# Altium schematic sheet [08] -LoRa_RAK3172.SchDoc
size A4
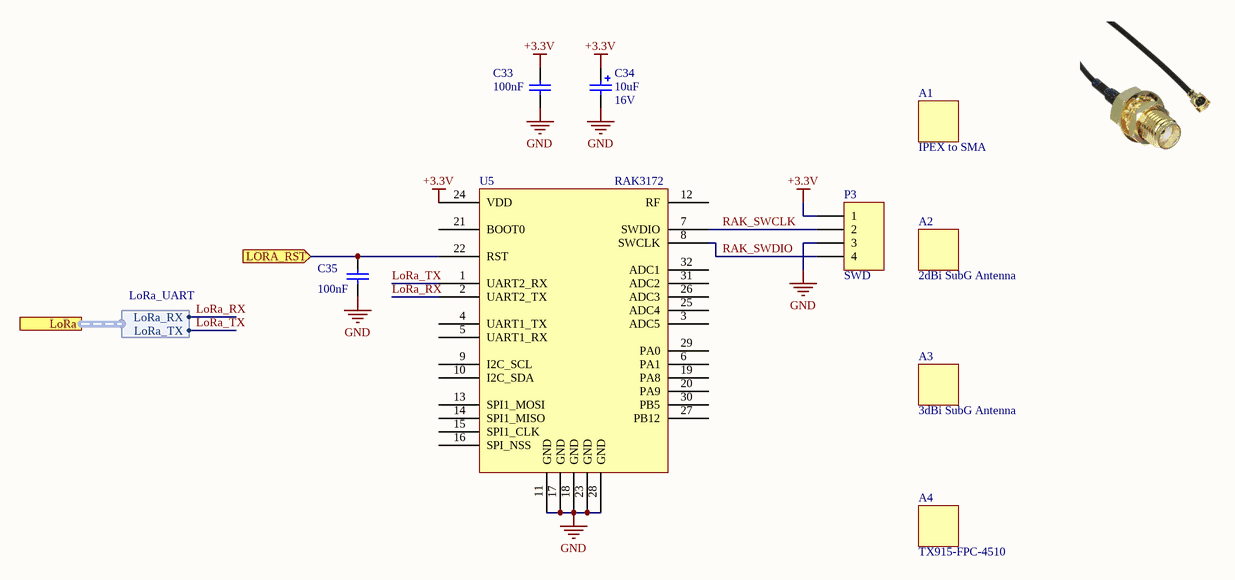
[diagram p0: [08] -LoRa_RAK3172.SchDoc]

## Parts
A1  IPEX to SMA  (mechanical)
A2  2dBi SubG Antenna  (mechanical)
A3  3dBi SubG Antenna  (mechanical)
A4  TX915-FPC-4510  (mechanical)
C33  Capacitance: 100nF  [Cap 0603]  (hidden comment: Capacitor)
C34  Capacitance: 10uF  Voltage Rating: 16V  [Tantalum 3216 A]  (hidden comment: Capacitor Polarized)
C35  Capacitance: 100nF  [Cap 0603]  (hidden comment: Capacitor)
P3  SWD  [HEADER SMD]
U5  RAK3172  [RAK3172]

## Ports
LoRa (harness LoRa_UART), LORA_RST (in)

## Harnesses
LoRa_UART: LoRa_RX, LoRa_TX

## Nets
+3.3V: C33.2 C34.1 P3.1 U5.24(VDD)
GND: C33.1 C34.2 C35.1 P3.3 U5.11(GND) U5.17(GND) U5.18(GND) U5.23(GND) U5.28(GND)
LORA_RST: C35.2 U5.22(RST) ; port LORA_RST
LoRa_RX: U5.2(UART2_TX) ; port LoRa.LoRa_RX
LoRa_TX: U5.1(UART2_RX) ; port LoRa.LoRa_TX
RAK_SWCLK: P3.2 U5.7(SWDIO)
RAK_SWDIO: P3.4 U5.8(SWCLK)

Not connected (* = marked no-connect by the designer): U5 3(ADC5) 4(UART1_TX) 5(UART1_RX) 6(PA1) 9(I2C_SCL) 10(I2C_SDA) 12(RF) 13(SPI1_MOSI) 14(SPI1_MISO) 15(SPI1_CLK) 16(SPI_NSS) 19(PA8) 20(PA9) 21(BOOT0) 25(ADC4) 26(ADC3) 27(PB12) 29(PA0) 30(PB5) 31(ADC2) 32(ADC1)

## Notes on the sheet
- Title
- Size:
- Date:
- A4
- Number:
- Time:
- Revision:
- Sheet
- of
- File:

## Library data of the parts
A1 = Mechanical_component: IPEX to SMA adapter cable; Manufacturer 1: Adam Equipment; Manufacturer Part Number 1: CA-DKCA0-305L0-AJI0-O; Supplier 1: Digi-Key; Supplier Part Number 1: 2057-CA-DKCA0-305L0-AJI0-O-ND; RoHS: No
A2 = Mechanical_component: Manufacturer 1: 5; Manufacturer Part Number 1: 2dBi SubG Antenna; Supplier Unit Price 1: *
A3 = Mechanical_component: Manufacturer 1: RAK; Manufacturer Part Number 1: 3dBi SubG Antenna; Supplier Unit Price 1: 7
A4 = Mechanical_component: TX915-FPC-4510 868~930MHz adhesive antenna; Manufacturer 1: EBYTE; Manufacturer Part Number 1: TX915-FPC-4510; Supplier Unit Price 1: 0,28
C33 C35 = 1: Cap Ceramic 0.1uF 50VDC X7R 10% SMD 0603 Paper T/R; Manufacturer: Samsung; Manufacturer Part Number: CL10B104KB8NNNC; Voltage Rating: 50V; ComponentLink1URL: http://www.kemet.com/docfinder?Partnumber=C0603C104K5RACTU; ComponentLink1Description: http://www.kemet.com/docfinder?Partnumber=C0603C104K5RACTU; ComponentLink2URL: https://datasheet.ciiva.com/25803/cl10b104kb8nnnc-25803393.pdf?src-supplier=Digi-Key; ComponentLink2Description: https://datasheet.ciiva.com/25803/cl10b104kb8nnnc-25803393.pdf?src-supplier=Digi-Key; ComponentLink3URL: https://datasheet.ciiva.com/26838/getdatasheetpartid-89097-26838411.pdf?src-supplier=Verical; ComponentLink3Description: https://datasheet.ciiva.com/26838/getdatasheetpartid-89097-26838411.pdf?src-supplier=Verical; ComponentLink4URL: https://datasheet.ciiva.com/29198/456651-da-01-en-vs-kondensator-0605-29198839.pdf?src-supplier=Conrad; ComponentLink4Description: https://datasheet.ciiva.com/29198/456651-da-01-en-vs-kondensator-0605-29198839.pdf?src-supplier=Conrad; Supplier 1: Digi-Key; Supplier Part Number 1: 1276-1000-1-ND; RoHS: Yes; Category: Ceramic Capacitors; Stock 1: 17279119; Pricing 1: 1=0,10000, 10=0,03200, 50=0,01720, 100=0,01410, 500=0,01008, 1000=0,00793 (USD); Mount: Surface Mount; Case/Package: 0603; Case Code (Metric): 1608; Case Code (Imperial): 0603; Material: Ceramic; Contact Plating: Tin; Min Operating Temperature: -55°C; Max Operating Temperature: 125°C; Tolerance: 10%; Package Quantity: 1; Packaging: Tape and Reel; Dielectric: X7R; Voltage: 50V; Voltage Rating (DC): 50V; Length: 1.6mm; Height: 0.8mm; Width: 0.031inch; Depth: 0.8mm; Thickness: 0.035inch; Radiation Hardening: No; Lead Free: Lead Free
C34 = 2: CAP TANT 10UF 10% 16V 1206; Manufacturer: Vishay Sprague; Manufacturer Part Number: 293D106X9016A2TE3; Dielectric Material: Tantalum; ESR (Equivalent Series Resistance): 3R; Ripple Current: 160mA; Leakage Current: 1.6uA; Polarity: Polar; Dissipation Factor: 6%; Q Factor: 6; Supplier 1: Digi-Key; Supplier Part Number 1: 718-1123-1-ND; RoHS: Yes; Category: Tantalum Capacitors; Stock 1: 76138; Pricing 1: 1=0,54000, 10=0,38000, 50=0,28720, 100=0,25010, 500=0,18524, 1000=0,15745 (USD); Mount: Surface Mount,PCB; Case/Package: 1206; Case Code (Imperial): 1206; Case Code (Metric): 3216; Min Operating Temperature: -55°C; Max Operating Temperature: 125°C; Tolerance: 10%; Packaging: Tape and Reel; Package Quantity: 1; Voltage Rating (DC): 16V; Termination: SMD/SMT; Voltage: 16V; Features: General Purpose; Series: TANTAMOUNT® 293D; Length: 3.2mm; Width: 1.6mm; Height: 1.6mm; Height - Seated (Max): 0.071inch; Depth: 1.6mm; Radiation Hardening: No; REACH SVHC: Unknown; Lead Free: Lead Free; RoHS Compliant: Yes; ComponentLink1URL: https://datasheet.ciiva.com/11793/0900766b80d97b37-11793412.pdf?src-supplier=RSComponents; ComponentLink1Description: https://datasheet.ciiva.com/11793/0900766b80d97b37-11793412.pdf?src-supplier=RSComponents; ComponentLink2URL: https://datasheet.ciiva.com/257/293d-257982.pdf?src-supplier=Digi-Key; ComponentLink2Description: https://datasheet.ciiva.com/257/293d-257982.pdf?src-supplier=Digi-Key; ComponentLink3URL: https://datasheet.ciiva.com/257/293d-257983.pdf?src-supplier=Digi-Key; ComponentLink3Description: https://datasheet.ciiva.com/257/293d-257983.pdf?src-supplier=Digi-Key; ComponentLink4URL: https://datasheet.ciiva.com/1463/293d-1463155.pdf?src-supplier=Element14; ComponentLink4Description: https://datasheet.ciiva.com/1463/293d-1463155.pdf?src-supplier=Element14; ComponentLink5URL: https://datasheet.ciiva.com/3003/293d-3003829.pdf?src-supplier=Avnet; ComponentLink5Description: https://datasheet.ciiva.com/3003/293d-3003829.pdf?src-supplier=Avnet; ComponentLink6URL: https://datasheet.ciiva.com/16308/293d-16308277.pdf?src-supplier=Future+Electronics; ComponentLink6Description: https://datasheet.ciiva.com/16308/293d-16308277.pdf?src-supplier=Future+Electronics; ComponentLink7URL: https://datasheet.ciiva.com/22695/1910915-22695111.pdf?src-supplier=Element14; ComponentLink7Description: https://datasheet.ciiva.com/22695/1910915-22695111.pdf?src-supplier=Element14; ComponentLink8URL: https://datasheet.ciiva.com/257/293d-257981.pdf?src-supplier=Digi-Key; ComponentLink8Description: https://datasheet.ciiva.com/257/293d-257981.pdf?src-supplier=Digi-Key
P3 = 5: CONN HEADER VERT 4POS 2.54MM; Manufacturer: Wurth Electronics; Manufacturer Part Number: 61300411121; Connector Type: Male Pin; Number of Positions: 4; Gender: Male; Pitch: 0.1inch; Supplier 1: Digi-Key; Supplier Part Number 1: 732-5317-ND; RoHS: Yes; Category: Connectors; Stock 1: 52329; Pricing 1: 1=0,18000, 10=0,15300, 25=0,12720, 50=0,10600, 100=0,09600, 1000=0,08800 (USD); Mount: Through Hole; Color: Black; Contact Plating: Gold; Contact Material: Copper; Packaging: Bulk; Termination: Solder; Number of Contacts: 4; Number of Rows: 1; Contact Mating Length: 0.236inch; REACH SVHC: Unknown; Lead Free: Lead Free; ComponentLink1URL: http://www.farnell.com/cad/1737268.pdf?src-supplier=Element14; ComponentLink1Description: http://www.farnell.com/cad/1737268.pdf?src-supplier=Element14; ComponentLink2URL: https://katalog.we-online.de/em/datasheet/6130xx11121.pdf?src-supplier=Digi-Key; ComponentLink2Description: https://katalog.we-online.de/em/datasheet/6130xx11121.pdf?src-supplier=Digi-Key
U5 = RAK3172: LPWAN Module; Manufacturer 1: RAK; Manufacturer Part Number 1: RAK3172; Supplier 1: RAK; Supplier Part Number 1: RAK3172; Pricing 1: 1=5,99; Mount: Surface Mount; Supplier Unit Price 1: 5,99